# EAGLE board 519_jetson_nano1017 (EAGLE 9.6.2), part 1 of 2
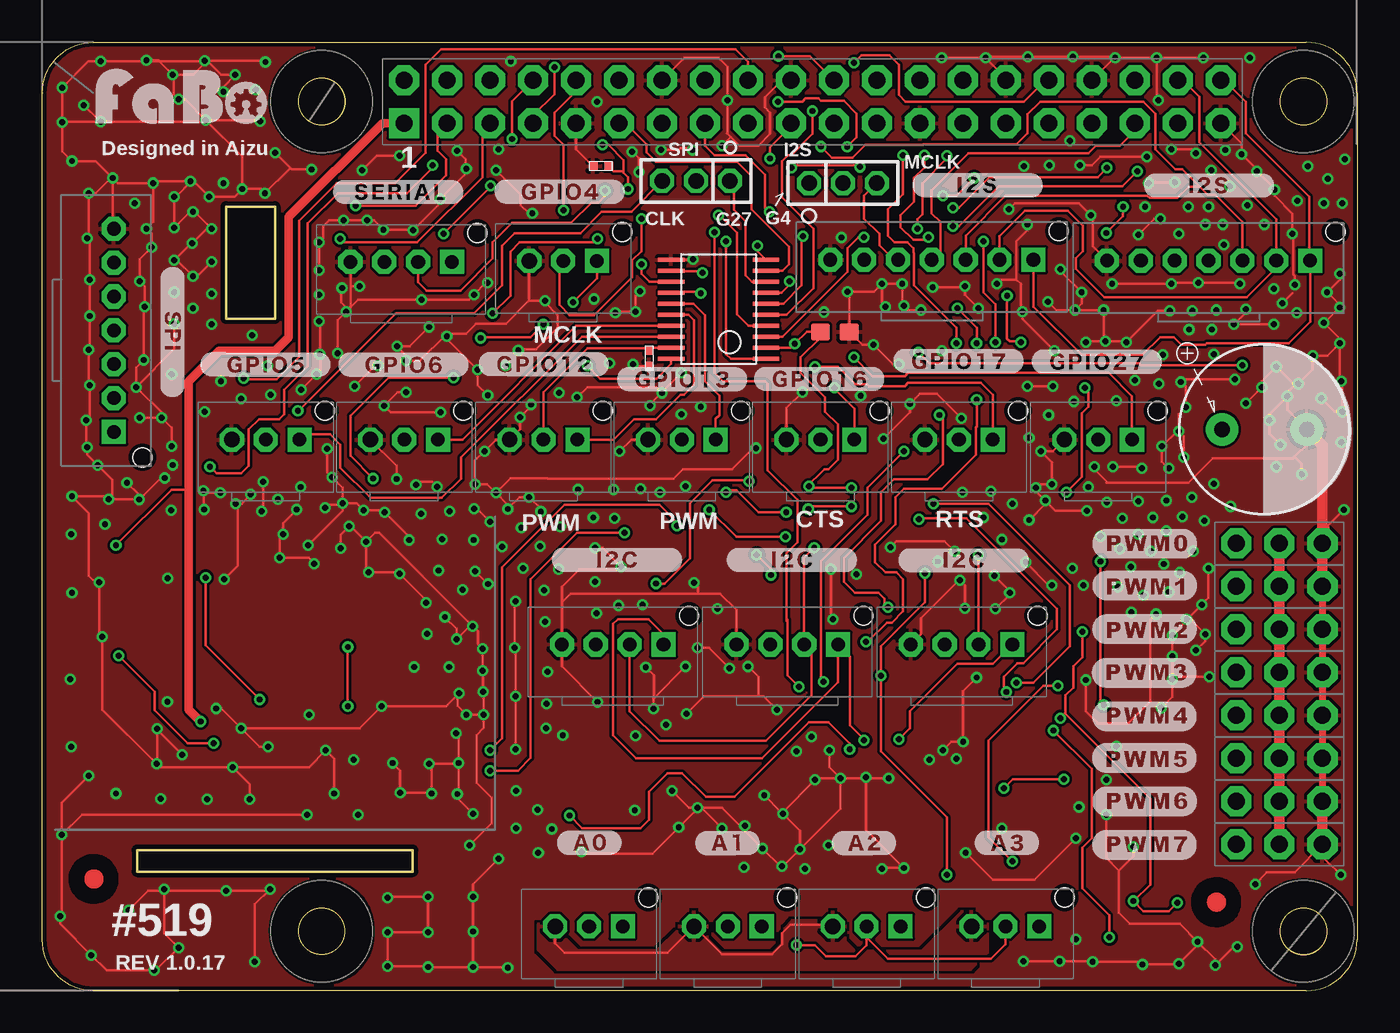
[diagram p6: board, top side]
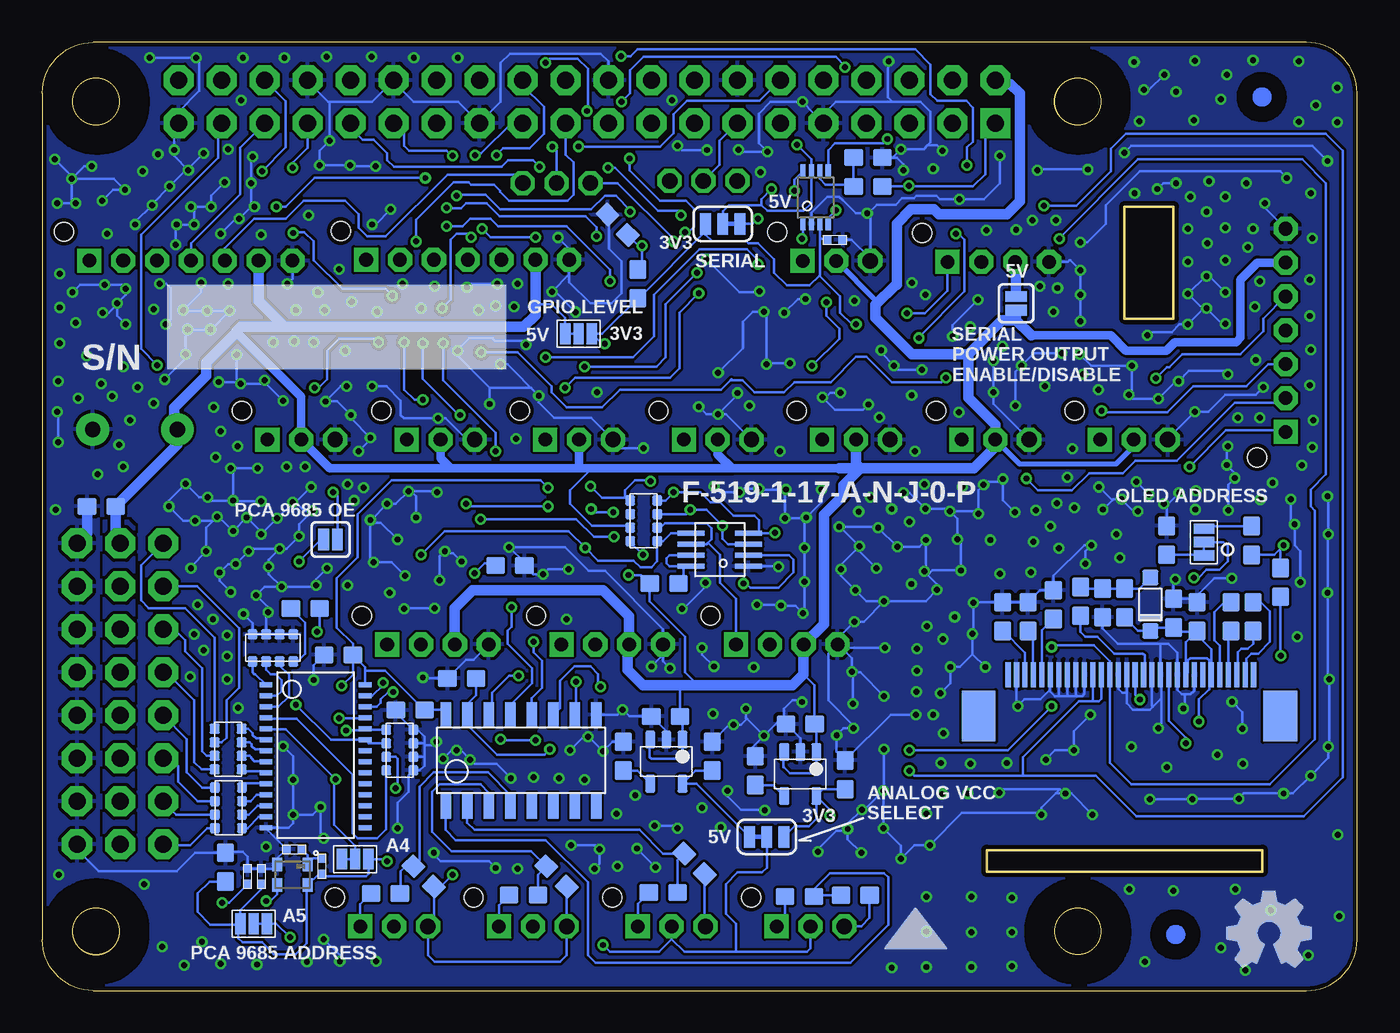
[diagram p7: board, bottom side, seen from below]

Size 77.68 x 56 mm. Coordinates in mm from the lower left corner, seen from the top.
Outline: 5.6,7.03 21.88,7.03 21.88,8.3 5.6,8.3 5.6,7.03
Outline: 10.85,46.29 13.75,46.29 13.75,39.69 10.85,39.69 10.85,46.29
Outline: circle at 16.51,52.51 radius 1.38
Outline: circle at 74.5,52.5 radius 1.38
Outline: circle at 16.5,3.5 radius 1.38
Outline: circle at 74.5,3.49 radius 1.38
Copper layers (1*16): Top 0.035mm / dielectric 1.6mm / Bottom 0.035mm
Design rules "PCBway": minimum track width 6mil, minimum drill 12mil, track to track 6mil, track to pad 6mil, pad to pad 6mil, via to via 6mil, smd to smd 6mil, copper to edge 10mil, drill to drill 10mil, minimum pad ring 10mil, minimum via ring 6mil, stop-mask expansion 2mil, vias tented up to drill 100mil, thermal gap 8mil
tKeepout: area 1,9.7 to 26.4,27.6
bKeepout: area 3.5,7.7 to 24.2,20; area 60.9,5.2 to 64.7,8.8
tRestrict: area 13.5,49.5 to 19.5,55.5; area 71.5,49.5 to 77.5,55.5; area 71.5,0.5 to 77.4,6.5; area 13.5,0.5 to 19.5,6.5
bRestrict: area 13.5,49.5 to 19.5,55.5; area 71.5,49.5 to 77.5,55.5; area 13.5,0.5 to 19.5,6.5; area 71.5,0.5 to 77.5,6.5; 8 lines

## Footprints (pad centres in the part's own frame; a part is rotated, then mirrored left to right if it is on the bottom)
FABO_BRICK_3PIN_B03B-PASK-1 = drill 0.9 pad 1.422 octagon: GND -2,0 | drill 0.8 pad 1.422 square: I/O 2,0 | drill 0.8 pad 1.422 octagon: VCC 0,0 | hole 1.1: 3.5,1.7
0603 = smd 1.1 x 1: 1 -0.85,0; 2 0.85,0
0402 = smd 0.5 x 0.5: P$1 -0.46,0; P$2 0.46,0
F13 = drill 0.9 pad 1.93: ANODE -2.5,0; CATHODE 2.5,0
1N4148W = smd 0.9 x 0.95: ANODE 0,0; CATHODE 3.15,0
FABO_BRICK_I2C_B04B-PASK-1 = drill 0.8 pad 1.422 octagon: GND -3,0; SDA 1,0; VCC -1,0 | drill 0.8 pad 1.422 square: SCL 3,0 | hole 1.1: 4.5,1.7
SPI-B07B-PASK-1 = drill 0.8 pad 1.422 octagon: 1 -6,1.27; 2 -4,1.27; 3 -2,1.27; 4 0,1.27; 5 2,1.27; 6 4,1.27 | drill 0.8 pad 1.422 square: 7 6,1.27 | hole 1.1: 7.5,2.97
8PIN-SSOP = smd 0.3 x 1.6: 1 -0.975,-1.7; 2 -0.325,-1.7; 3 0.325,-1.7; 4 0.975,-1.7; 5 0.975,1.7; 6 0.325,1.7; 7 -0.325,1.7; 8 -0.975,1.7
SOT-23-5 = smd 0.6 x 1.05: 1 -0.95,-1.3; 2 0,-1.3; 3 0.95,-1.3; 4 0.95,1.3; 5 -0.95,1.3
MICROCHIP-MCP3008 = smd 0.6 x 1.5: 1 -4.445,-2.7; 2 -3.175,-2.7; 3 -1.905,-2.7; 4 -0.635,-2.7; 5 0.635,-2.7; 6 1.905,-2.7; 7 3.175,-2.7; 8 4.445,-2.7; 9 4.445,2.7; 10 3.175,2.7; 11 1.905,2.7; 12 0.635,2.7; 13 -0.635,2.7; 14 -1.905,2.7; 15 -3.175,2.7; 16 -4.445,2.7
JUMPERS_JP2-2MM = drill 0.914 octagon: 1 -2,0; 2 0,0; 3 2,0
SMT-JUMPER_2_NC_PASTE_SILK = smd 0.635 x 1.27: 1 -0.406,0; 2 0.406,0
SMT-JUMPER_3_1-NC_TRACE_SILK = smd 0.635 x 1.27: 1 -1.016,0; 2 0,0; 3 1.016,0
FABO_BRICK_3PIN_HEADER = drill 1 pad 1.778 octagon: GND -2.54,0; I/O 2.54,0; VCC 0,0
EXBV8V = smd 0.6 x 0.6: 1 -1.2,-0.8; 2 -0.4,-0.8; 3 0.4,-0.8; 4 1.2,-0.8; 5 1.2,0.8; 6 0.4,0.8; 7 -0.4,0.8; 8 -1.2,0.8
FABO_BRICK_SERIAL_B04B-PASK-1 = drill 0.8 pad 1.422 octagon: GND -3,0; TX 1,0; VCC -1,0 | drill 0.8 pad 1.422 square: RX 3,0 | hole 1.1: 4.5,1.7
SMD-JUMPER-3 = smd 0.61 x 1.219: 1 -0.787,0; 2 0,0; 3 0.787,0
ER-CON30HT-1 = smd 0.3 x 1.5 bottom: 1 7,-0.23; 2 6.5,-0.23; 3 6,-0.23; 4 5.5,-0.23; 5 5,-0.23; 6 4.5,-0.23; 7 4,-0.23; 8 3.5,-0.23; 9 3,-0.23; 10 2.5,-0.23; 11 2,-0.23; 12 1.5,-0.23; 13 1,-0.23; 14 0.5,-0.23; 15 0,-0.23; 16 -0.5,-0.23; 17 -1,-0.23; 18 -1.5,-0.23; 19 -2,-0.23; 20 -2.5,-0.23; 21 -3,-0.23; 22 -3.5,-0.23; 23 -4,-0.23; 24 -4.5,-0.23; 25 -5,-0.23; 26 -5.5,-0.23; 27 -6,-0.23; 28 -6.5,-0.23; 29 -7,-0.23; 30 -7.5,-0.23 | smd 2 x 3 bottom: 31 -9.07,-2.67; 32 8.74,-2.67
R-PUSON-N20 = smd 0.25 x 1.55: 1 -2.925,-2.8; 2 -2.275,-2.8; 3 -1.625,-2.8; 4 -0.975,-2.8; 5 -0.325,-2.8; 6 0.325,-2.8; 7 0.975,-2.8; 8 1.625,-2.8; 9 2.275,-2.8; 10 2.925,-2.8; 11 2.925,2.8; 12 2.275,2.8; 13 1.625,2.8; 14 0.975,2.8; 15 0.325,2.8; 16 -0.325,2.8; 17 -0.975,2.8; 18 -1.625,2.8; 19 -2.275,2.8; 20 -2.925,2.8
JETSON_NANO_COMPA = drill 1 pad 1.778 square: 1 -17.78,15.24 | drill 1 pad 1.778 octagon: 2 -17.78,17.78; 3 -15.24,15.24; 4 -15.24,17.78; 5 -12.7,15.24; 6 -12.7,17.78; 7 -10.16,15.24; 8 -10.16,17.78; 9 -7.62,15.24; 10 -7.62,17.78; 11 -5.08,15.24; 12 -5.08,17.78; 13 -2.54,15.24; 14 -2.54,17.78; 15 0,15.24; 16 0,17.78; 17 2.54,15.24; 18 2.54,17.78; 19 5.08,15.24; 20 5.08,17.78; 21 7.62,15.24; 22 7.62,17.78; 23 10.16,15.24; 24 10.16,17.78; 25 12.7,15.24; 26 12.7,17.78; 27 15.24,15.24; 28 15.24,17.78; 29 17.78,15.24; 30 17.78,17.78; 31 20.32,15.24; 32 20.32,17.78; 33 22.86,15.24; 34 22.86,17.78; 35 25.4,15.24; 36 25.4,17.78; 37 27.94,15.24; 38 27.94,17.78; 39 30.48,15.24; 40 30.48,17.78
VSSOP8 = smd 0.3 x 0.8: 1 -0.75,-1.55; 2 -0.25,-1.55; 3 0.25,-1.55; 4 0.75,-1.55; 5 0.75,1.55; 6 0.25,1.55; 7 -0.25,1.55; 8 -0.75,1.55
PCA9685 = smd 0.3 x 0.75: 1 -4.15,-2.93; 2 -3.5,-2.93; 3 -2.85,-2.93; 4 -2.2,-2.93; 5 -1.55,-2.93; 6 -0.9,-2.93; 7 -0.25,-2.93; 8 0.4,-2.93; 9 1.05,-2.93; 10 1.7,-2.93; 11 2.35,-2.93; 12 3,-2.93; 13 3.65,-2.93; 14 4.3,-2.93; 15 4.3,2.92; 16 3.65,2.92; 17 3,2.92; 18 2.35,2.92; 19 1.7,2.92; 20 1.05,2.92; 21 0.4,2.92; 22 -0.25,2.92; 23 -0.9,2.92; 24 -1.55,2.92; 25 -2.2,2.92; 26 -2.85,2.92; 27 -3.5,2.92; 28 -4.15,2.92
KC2016Z = smd 0.6 x 0.8: #1 -0.9,-0.6; #2 0.9,-0.6; #3 0.9,0.6; #4 -0.9,0.6

## Placement (x,y rotation side)
A0  [FABO_BRICK_3PIN_B03B-PASK-1]  32.3,3.79 0 top
A1  [FABO_BRICK_3PIN_B03B-PASK-1]  40.5,3.79 0 top
A2  [FABO_BRICK_3PIN_B03B-PASK-1]  48.7,3.79 0 top
A3  [FABO_BRICK_3PIN_B03B-PASK-1]  56.9,3.79 0 top
C1  10uF  [0603]  20.95,22.09 270 bottom
C2  10uF  [0603]  19.45,22.09 270 bottom
C3  10uF  [0603]  15.05,22.89 90 bottom
C4  1uF  [0603]  7.45,22.09 270 bottom
C5  1uF  [0603]  6.15,22.09 90 bottom
C6  1uF  [0603]  9.45,22.09 270 bottom
C7  0.1uF  [0603]  66.85,7.29 90 bottom
C8  0.1uF  [0603]  46.83,38.91 180 top
C9  0.1uF  [0603]  52.9,18.44 0 bottom
C10  0.1uF  [0402]  35.85,37.34 90 top
C11  1uF  [0603]  40.85,16.19 0 bottom
C12  0.1uF  [0603]  74.19,28.6 180 bottom
C13  0.1uF  [0402]  64.75,6.74 270 bottom
C14  20pF  [0402]  65.55,6.74 270 bottom
C15  1uF  [0603]  10.85,22.29 270 bottom
C16  0.01uF  [0603]  43.35,13.84 270 bottom
C17  4.7uF  [0603]  38.1,13.84 270 bottom
C18  0.1uF  [0402]  30.85,44.34 0 bottom
C19  0.1uF/0402  [0402]  33,48.69 0 top
C20  10uF  [0603]  60.18,19.82 180 bottom
C21  0.1uF  [0603]  55.95,16.56 0 bottom
C22  4.7uF  [0603]  30.25,12.74 270 bottom
C23  0.01uF  [0603]  35.55,12.99 270 bottom
C24  1uF  [0603]  32.9,15.74 0 bottom
C100  16SEPF1000M,1000uF/16V/Size_F13  [F13]  72.2,33.14 0 top
D1  1N4148  [1N4148W]  12.22,24.39 270 bottom
GPIO4  [FABO_BRICK_3PIN_B03B-PASK-1]  30.77,43.09 0 top
GPIO5  [FABO_BRICK_3PIN_B03B-PASK-1]  13.2,32.54 0 top
GPIO6  [FABO_BRICK_3PIN_B03B-PASK-1]  21.38,32.54 0 top
GPIO12  [FABO_BRICK_3PIN_B03B-PASK-1]  29.61,32.54 0 top
GPIO13  [FABO_BRICK_3PIN_B03B-PASK-1]  37.78,32.54 0 top
GPIO16  [FABO_BRICK_3PIN_B03B-PASK-1]  45.97,32.54 0 top
GPIO17  [FABO_BRICK_3PIN_B03B-PASK-1]  54.15,32.54 0 top
GPIO27  [FABO_BRICK_3PIN_B03B-PASK-1]  62.38,32.54 0 top
I2C0  [FABO_BRICK_I2C_B04B-PASK-1]  33.7,20.44 0 top
I2C1  [FABO_BRICK_I2C_B04B-PASK-1]  44.01,20.44 0 top
I2C2  [FABO_BRICK_I2C_B04B-PASK-1]  54.31,20.44 0 top
I2S0  FABO-I2S-7PIN  [SPI-B07B-PASK-1]  52.55,41.89 0 top
I2S1  FABO-I2S-7PIN  [SPI-B07B-PASK-1]  68.9,41.84 0 top
IC1  [8PIN-SSOP]  37.65,26.04 90 bottom
IC2  [SOT-23-5]  40.81,13.52 180 bottom
IC3  [MICROCHIP-MCP3008]  49.4,13.59 0 bottom
IC4  [SOT-23-5]  32.9,12.79 180 bottom
JP1  JUMPERS_JP2-2MM  [JUMPERS_JP2-2MM]  47.3,47.69 0 top
JP2  JUMPER-SMT_2_NC_PASTE_SILK  [SMT-JUMPER_2_NC_PASTE_SILK]  20.15,40.59 270 bottom
JP3  JUMPER-SMT_3_1-NC_TRACE_SILK  [SMT-JUMPER_3_1-NC_TRACE_SILK]  37.48,45.28 0 bottom
JP4  JUMPERS_JP2-2MM  [JUMPERS_JP2-2MM]  38.62,47.82 180 top
JP5  JUMPER-SMT_3_1-NC_TRACE_SILK  [SMT-JUMPER_3_1-NC_TRACE_SILK]  34.88,9.08 180 bottom
JP6  JUMPER-SMT_2_NC_PASTE_SILK  [SMT-JUMPER_2_NC_PASTE_SILK]  60.65,26.64 0 bottom
LOGO1  [LOGO_FABO_M]  8.23,50.82 0 top
PWM0  [FABO_BRICK_3PIN_HEADER]  73.09,26.41 180 top
PWM1  [FABO_BRICK_3PIN_HEADER]  73.09,23.87 180 top
PWM2  [FABO_BRICK_3PIN_HEADER]  73.09,21.33 180 top
PWM3  [FABO_BRICK_3PIN_HEADER]  73.09,18.79 180 top
PWM4  [FABO_BRICK_3PIN_HEADER]  73.09,16.25 180 top
PWM5  [FABO_BRICK_3PIN_HEADER]  73.09,13.71 180 top
PWM6  [FABO_BRICK_3PIN_HEADER]  73.09,11.17 180 top
PWM7  [FABO_BRICK_3PIN_HEADER]  73.09,8.63 180 top
R1  10k  [EXBV8V]  64.06,20.23 180 bottom
R2  10k  [EXBV8V]  56.56,14.2 90 bottom
R3  220  [EXBV8V]  66.7,14.26 90 bottom
R4  4.7K  [0603]  32.95,5.56 0 bottom
R5  220  [EXBV8V]  66.68,10.79 90 bottom
R6  4.7K  [0603]  11.25,26.59 270 bottom
R7  0  [0402]  61.15,7.34 270 bottom
R8  10K  [EXBV8V]  42.15,27.74 90 bottom
R9  200K  [0603]  40.95,24.04 180 bottom
R10  9.1K  [0603]  29.65,5.63 180 bottom
R11  4.7K  [0603]  41,5.79 0 bottom
R12  4.7K  [0603]  49.25,5.64 0 bottom
R13  4.7K  [0603]  57.4,5.74 0 bottom
R14  9.1K  [0603]  39.15,7.49 135 bottom
R15  9.1K  [0603]  47.3,6.74 135 bottom
R16  9.1K  [0603]  55.15,6.74 135 bottom
R17  20K  [0603]  28.9,47.49 0 bottom
R18  0  [0603]  62.15,22.56 0 bottom
R19  390K  [0603]  17.95,22.79 270 bottom
R20  4.7K  [0603]  6.23,26.58 270 bottom
R21  1M  [0603]  28.9,49.19 180 bottom
R22  DNP  [0402]  62.8,8.34 0 bottom
R23  20K  [0603]  42.5,41.74 270 bottom
R24  1M  [0603]  43.69,45.23 315 bottom
R25  100  [0603]  16.35,22.99 90 bottom
R26  10K  [0603]  13.75,22.89 270 bottom
R27  10K  [0603]  4.54,24.11 90 bottom
R28  0  [0603]  50.05,25.09 0 bottom
SERIAL  [FABO_BRICK_SERIAL_B04B-PASK-1]  21.2,43.04 0 top
SJ2  [SMD-JUMPER-3]  65.19,3.95 0 bottom
SJ3  [SMD-JUMPER-3]  46,38.79 180 bottom
SJ5  [SMD-JUMPER-3]  59.2,7.76 180 bottom
SJ6  [SMD-JUMPER-3]  9.05,26.49 270 bottom
SPI1  FABO-SPI-7PIN  [SPI-B07B-PASK-1]  2.95,38.99 270 top
U1  [ER-CON30HT-1]  13.62,18.88 0 top
U2  TXB0108  [R-PUSON-N20]  39.95,40.24 90 top
U$2  JETSON_NANOJETSON_NANO_COMPA  [JETSON_NANO_COMPA]  39.15,35.99 0 top
U$3  [MARK_POINT_3MM]  3.05,6.59 0 top
U$4  [MARK_POINT_3MM]  69.37,5.22 0 top
U$5  [MARK_POINT_3MM]  10.72,3.31 0 bottom
U$6  [MARK_POINT_3MM]  5.62,52.77 0 bottom
U$7  TXB0102  [VSSOP8]  32,46.84 0 bottom
U$8  LOGO_OSHW-M_BOTTOM  [LOGO_OSHW_M_BOTTOM]  5.2,3.4 0 top
U$9  PCA9685  [PCA9685]  61.53,13.9 270 bottom
U$11  KC2016Z  [KC2016Z]  62.9,6.84 180 bottom